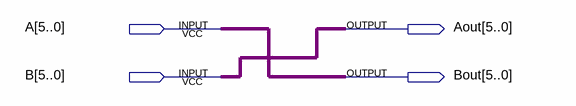
[diagram p0: schematic sheet]
// Quartus schematic swap.bdf as structural Verilog: 0 symbols, 4 pins
module swap (
  input  [5:0] A,
  input  [5:0] B,
  output [5:0] Aout,
  output [5:0] Bout
);


  assign Aout = B;
  assign Bout = A;
endmodule
